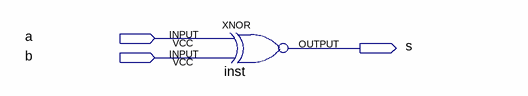
[diagram p0: schematic sheet]
// Quartus schematic comparadorBit-Bit-OK.bdf as structural Verilog: 1 symbols, 3 pins
module \comparadorBit-Bit-OK  (
  input  a,
  input  b,
  output s
);

  xnor inst (s, a, b);
endmodule
